# Altium schematic sheet esp32_with_usbc_1st.SchDoc
size A2; SheetNumber: 1; SheetTotal: 1
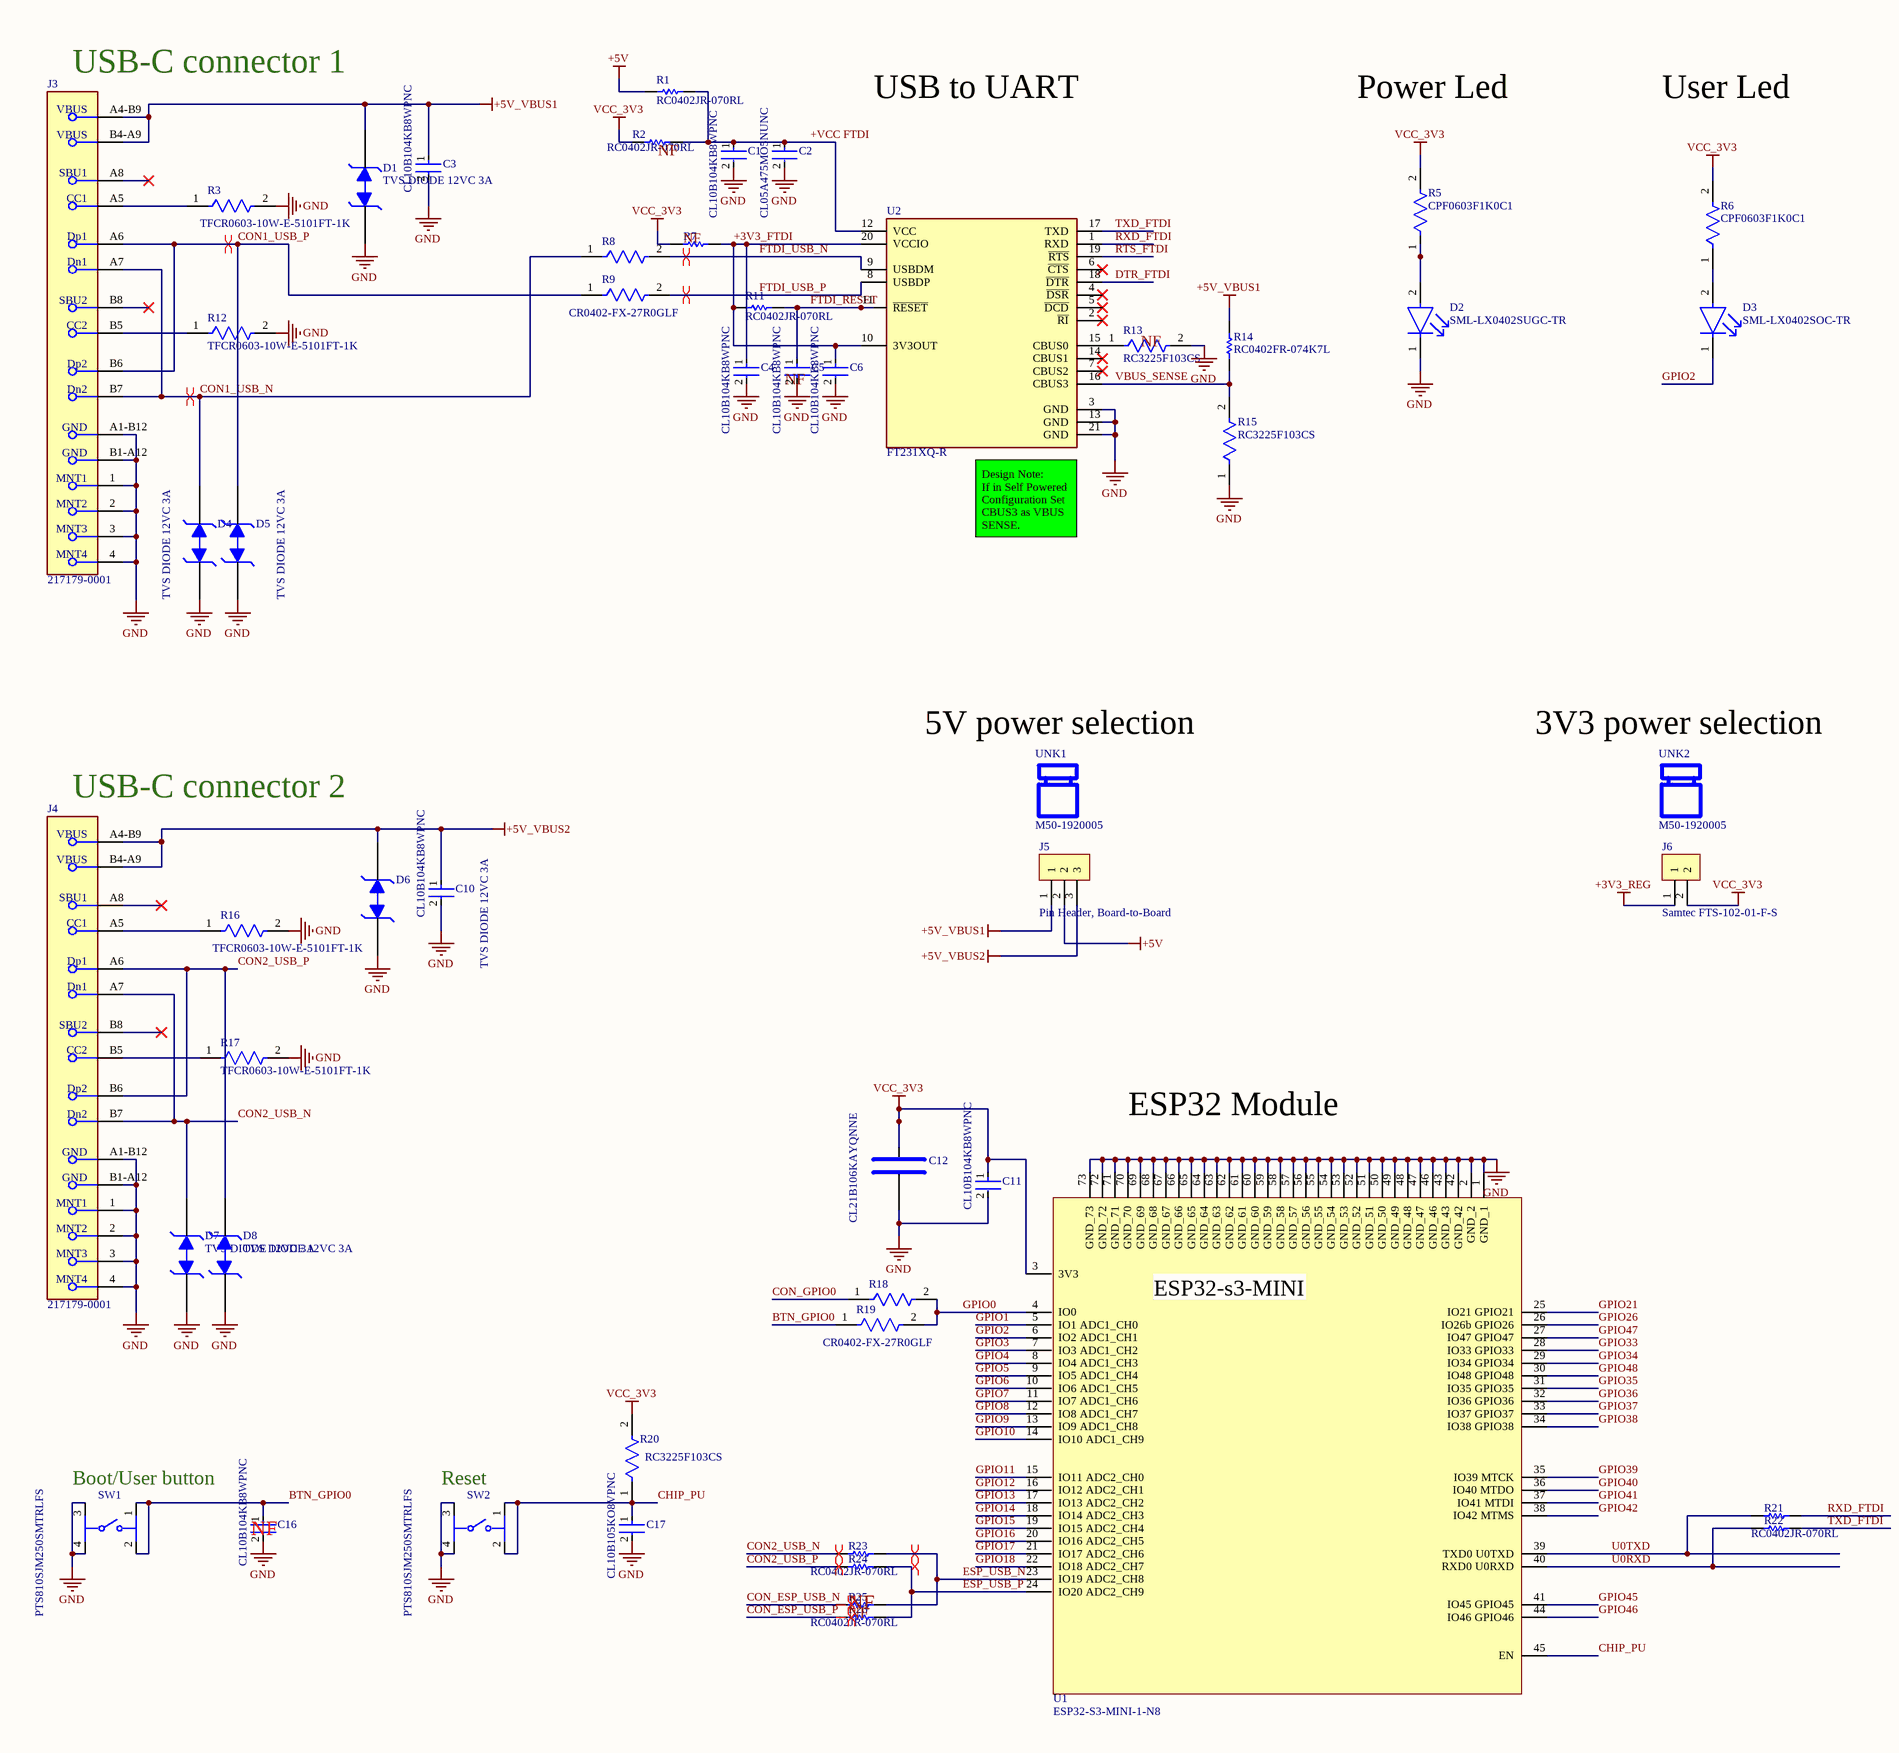
[diagram p0: esp32_with_usbc_1st.SchDoc, left]
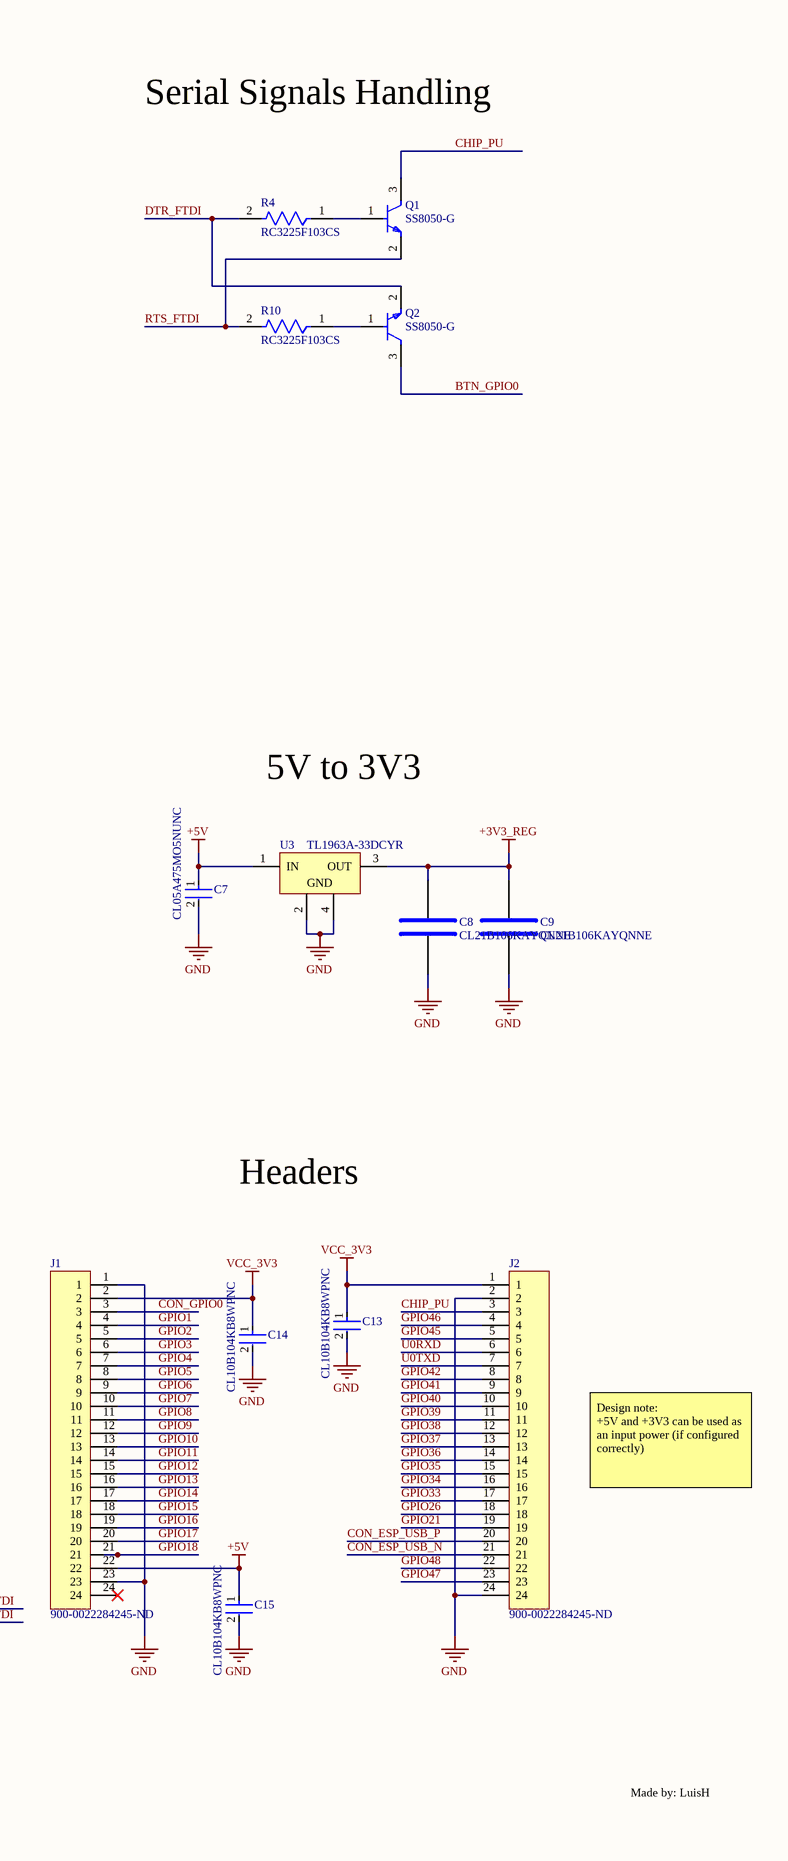
[diagram p1: esp32_with_usbc_1st.SchDoc, right]

## Parts
C1  CL10B104KB8WPNC  [FP-CL10-IPC_A]
C2  CL05A475MO5NUNC  [FP-CL829-IPC_C]
C3  CL10B104KB8WPNC  [FP-CL10-IPC_A]
C4  CL10B104KB8WPNC  [FP-CL10-IPC_A]
C5  CL10B104KB8WPNC  [FP-CL10-IPC_A]
C6  CL10B104KB8WPNC  [FP-CL10-IPC_A]
C7  CL05A475MO5NUNC  [FP-CL829-IPC_C]
C8  CL21B106KAYQNNE  [CAP_CL21B106KAYQNNE_SAM-L]
C9  CL21B106KAYQNNE  [CAP_CL21B106KAYQNNE_SAM-L]
C10  CL10B104KB8WPNC  [FP-CL10-IPC_A]
C11  CL10B104KB8WPNC  [FP-CL10-IPC_A]
C12  CL21B106KAYQNNE  [CAP_CL21B106KAYQNNE_SAM-L]
C13  CL10B104KB8WPNC  [FP-CL10-IPC_A]
C14  CL10B104KB8WPNC  [FP-CL10-IPC_A]
C15  CL10B104KB8WPNC  [FP-CL10-IPC_A]
C16  CL10B104KB8WPNC  [FP-CL10-IPC_A]
C17  CL10B105KO8VPNC  [FP-CL10-IPC_C]
D1  TVS DIODE 12VC 3A  [RTVS_SOD882_LTF]
D2  SML-LX0402SUGC-TR  [FP-SML-LX0402SUGC-TR-MFG]
D3  SML-LX0402SOC-TR  [FP-SML-LX0402SOC-TR-MFG]
D4  TVS DIODE 12VC 3A  [RTVS_SOD882_LTF]
D5  TVS DIODE 12VC 3A  [RTVS_SOD882_LTF]
D6  TVS DIODE 12VC 3A  [RTVS_SOD882_LTF]
D7  TVS DIODE 12VC 3A  [RTVS_SOD882_LTF]
D8  TVS DIODE 12VC 3A  [RTVS_SOD882_LTF]
J1  900-0022284245-ND  [CONN_SD-42375-001_M295_24_MOL]
J2  900-0022284245-ND  [CONN_SD-42375-001_M295_24_MOL]
J3  217179-0001  [FP-2171790001-MFG]
J4  217179-0001  [FP-2171790001-MFG]
J5  Pin Header, Board-to-Board  [HDR_1x3_1.27mm]
J6  Samtec FTS-102-01-F-S  [HDR_1x2_1.27mm]
Q1  SS8050-G  [FP-SS8050-G-MFG]
Q2  SS8050-G  [FP-SS8050-G-MFG]
R1  RC0402JR-070RL  [RESC1005X40X25NL05T10]
R2  RC0402JR-070RL  [RESC1005X40X25NL05T10]
R3  TFCR0603-10W-E-5101FT-1K  [FP-TFCR0603-IPC_C]
R4  RC3225F103CS  [FP-RC3225-IPC_C]
R5  CPF0603F1K0C1  [FP-CPF0603-MFG]
R6  CPF0603F1K0C1  [FP-CPF0603-MFG]
R7  RC0402JR-070RL  [RESC1005X40X25NL05T10]  (value not drawn)
R8  CR0402-FX-27R0GLF  [FP-CR0402-MFG]
R9  CR0402-FX-27R0GLF  [FP-CR0402-MFG]  (value not drawn)
R10  RC3225F103CS  [FP-RC3225-IPC_C]
R11  RC0402JR-070RL  [RESC1005X40X25NL05T10]
R12  TFCR0603-10W-E-5101FT-1K  [FP-TFCR0603-IPC_C]
R13  RC3225F103CS  [FP-RC3225-IPC_C]
R14  RC0402FR-074K7L  [RESC1005X40X25NL05T10]
R15  RC3225F103CS  [FP-RC3225-IPC_C]
R16  TFCR0603-10W-E-5101FT-1K  [FP-TFCR0603-IPC_C]
R17  TFCR0603-10W-E-5101FT-1K  [FP-TFCR0603-IPC_C]
R18  CR0402-FX-27R0GLF  [FP-CR0402-MFG]
R19  CR0402-FX-27R0GLF  [FP-CR0402-MFG]  (value not drawn)
R20  RC3225F103CS  [FP-RC3225-IPC_C]
R21  RC0402JR-070RL  [RESC1005X40X25NL05T10]
R22  RC0402JR-070RL  [RESC1005X40X25NL05T10]  (value not drawn)
R23  RC0402JR-070RL  [RESC1005X40X25NL05T10]  (value not drawn)
R24  RC0402JR-070RL  [RESC1005X40X25NL05T10]
R25  RC0402JR-070RL  [RESC1005X40X25NL05T10]  (value not drawn)
R26  RC0402JR-070RL  [RESC1005X40X25NL05T10]
SW1  PTS810SJM250SMTRLFS  [FP-PTS810SJM250SMTRLFS-MFG]
SW2  PTS810SJM250SMTRLFS  [FP-PTS810SJM250SMTRLFS-MFG]
U1  ESP32-S3-MINI-1-N8  [XCVR_ESP32-S3-MINI-1-N8]
U2  FT231XQ-R  [FP-QFN-20-IPC_B]
U3  TL1963A-33DCYR  [DCY0004A_N]
UNK1  M50-1920005  (mechanical)
UNK2  M50-1920005  (mechanical)

## Nets
+3V3_REG: C8.2 C9.2 J6.1 U3.3(OUT)
+5V: C7.1 C15.1 J1.22 J5.2 R1.1 U3.1(IN)
+5V_VBUS1: C3.1 D1.2 J3.A4-B9(VBUS) J3.B4-A9(VBUS) J5.1 R14.2
+5V_VBUS2: C10.1 D6.2 J4.A4-B9(VBUS) J4.B4-A9(VBUS) J5.3
GND: C1.2 C2.2 C3.2 C4.2 C5.2 C6.2 C7.2 C8.1 C9.1 C10.2 C11.2 C12.1 C13.2 C14.2 C15.2 C16.2 C17.2 D1.1 D2.1(C) D4.1 D5.1 D6.1 D7.1 D8.1 J1.1 J1.23 J2.2 J2.24 J3.1(GND) J3.2(GND) J3.3(GND) J3.4(GND) J3.A1-B12(GND) J3.B1-A12(GND) J4.1(GND) J4.2(GND) J4.3(GND) J4.4(GND) J4.A1-B12(GND) J4.B1-A12(GND) R3.2 R12.2 R13.2 R15.1 R16.2 R17.2 SW1.3 SW1.4 SW2.3 SW2.4 U1.1(GND_1) U1.2(GND_2) U1.42(GND_42) U1.43(GND_43) U1.46(GND_46) U1.47(GND_47) U1.48(GND_48) U1.49(GND_49) U1.50(GND_50) U1.51(GND_51) U1.52(GND_52) U1.53(GND_53) U1.54(GND_54) U1.55(GND_55) U1.56(GND_56) U1.57(GND_57) U1.58(GND_58) U1.59(GND_59) U1.60(GND_60) U1.61(GND_61) U1.62(GND_62) U1.63(GND_63) U1.64(GND_64) U1.65(GND_65) U1.66(GND_66) U1.67(GND_67) U1.68(GND_68) U1.69(GND_69) U1.70(GND_70) U1.71(GND_71) U1.72(GND_72) U1.73(GND_73) U2.3(GND) U2.13(GND) U2.21(GND) U3.2(GND) U3.4(GND)
VCC_3V3: C11.1 C12.2 C13.1 C14.1 J1.2 J2.1 J6.2 R2.1 R5.2 R6.2 R7.1 R20.2 U1.3(3V3)
+3V3_FTDI: C4.1 C6.1 R7.2 R11.1 U2.10(3V3OUT) U2.20(VCCIO)
+VCC FTDI: C1.1 C2.1 R1.2 R2.2 U2.12(VCC)
BTN_GPIO0: C16.1 Q2.3(C) R19.1 SW1.1 SW1.2
CHIP_PU: C17.1 J2.3 Q1.3(C) R20.1 SW2.1 SW2.2 U1.45(EN)
CON1_USB_N: D4.2 J3.A7(Dn1) J3.B7(Dn2) R8.1
CON1_USB_P: D5.2 J3.A6(Dp1) J3.B6(Dp2) R9.1
CON2_USB_N: D7.2 J4.A7(Dn1) J4.B7(Dn2) R23.1
CON2_USB_P: D8.2 J4.A6(Dp1) J4.B6(Dp2) R24.1
CON_ESP_USB_N: J2.21 R25.1
CON_ESP_USB_P: J2.20 R26.1
CON_GPIO0: J1.3 R18.1
DTR_FTDI: Q2.2(E) R4.2 U2.18(~{DTR})
ESP_USB_N: R23.2 R25.2 U1.23(IO19_ADC2_CH8)
ESP_USB_P: R24.2 R26.2 U1.24(IO20_ADC2_CH9)
FTDI_RESET: C5.1 R11.2 U2.11(~{RESET})
FTDI_USB_N: R8.2 U2.9(USBDM)
FTDI_USB_P: R9.2 U2.8(USBDP)
GPIO0: R18.2 R19.2 U1.4(IO0)
GPIO1: J1.4 U1.5(IO1_ADC1_CH0)
GPIO2: D3.1(C) J1.5 U1.6(IO2_ADC1_CH1)
GPIO3: J1.6 U1.7(IO3_ADC1_CH2)
GPIO4: J1.7 U1.8(IO4_ADC1_CH3)
GPIO5: J1.8 U1.9(IO5_ADC1_CH4)
GPIO6: J1.9 U1.10(IO6_ADC1_CH5)
GPIO7: J1.10 U1.11(IO7_ADC1_CH6)
GPIO8: J1.11 U1.12(IO8_ADC1_CH7)
GPIO9: J1.12 U1.13(IO9_ADC1_CH8)
GPIO10: J1.13 U1.14(IO10_ADC1_CH9)
GPIO11: J1.14 U1.15(IO11_ADC2_CH0)
GPIO12: J1.15 U1.16(IO12_ADC2_CH1)
GPIO13: J1.16 U1.17(IO13_ADC2_CH2)
GPIO14: J1.17 U1.18(IO14_ADC2_CH3)
GPIO15: J1.18 U1.19(IO15_ADC2_CH4)
GPIO16: J1.19 U1.20(IO16_ADC2_CH5)
GPIO17: J1.20 U1.21(IO17_ADC2_CH6)
GPIO18: J1.21 U1.22(IO18_ADC2_CH7)
GPIO21: J2.19 U1.25(IO21_GPIO21)
GPIO26: J2.18 U1.26(IO26b_GPIO26)
GPIO33: J2.17 U1.28(IO33_GPIO33)
GPIO34: J2.16 U1.29(IO34_GPIO34)
GPIO35: J2.15 U1.31(IO35_GPIO35)
GPIO36: J2.14 U1.32(IO36_GPIO36)
GPIO37: J2.13 U1.33(IO37_GPIO37)
GPIO38: J2.12 U1.34(IO38_GPIO38)
GPIO39: J2.11 U1.35(IO39_MTCK)
GPIO40: J2.10 U1.36(IO40_MTDO)
GPIO41: J2.9 U1.37(IO41_MTDI)
GPIO42: J2.8 U1.38(IO42_MTMS)
GPIO45: J2.5 U1.41(IO45_GPIO45)
GPIO46: J2.4 U1.44(IO46_GPIO46)
GPIO47: J2.23 U1.27(IO47_GPIO47)
GPIO48: J2.22 U1.30(IO48_GPIO48)
RTS_FTDI: Q1.2(E) R10.2 U2.19(~{RTS})
RXD_FTDI: R21.2 U2.1(RXD)
TXD_FTDI: R22.2 U2.17(TXD)
U0RXD: J2.6 R22.1 U1.40(RXD0_U0RXD)
U0TXD: J2.7 R21.1 U1.39(TXD0_U0TXD)
VBUS_SENSE: R14.1 R15.2 U2.16(CBUS3)
NetD2_2: D2.2(A) R5.1
NetD3_2: D3.2(A) R6.1
NetJ3_A5: J3.A5(CC1) R3.1
NetJ3_B5: J3.B5(CC2) R12.1
NetJ4_A5: J4.A5(CC1) R16.1
NetJ4_B5: J4.B5(CC2) R17.1
NetQ1_1: Q1.1(B) R4.1
NetQ2_1: Q2.1(B) R10.1
NetR13_1: R13.1 U2.15(CBUS0)

Not connected (* = marked no-connect by the designer): J1 24*; J3 A8(SBU1)* B8(SBU2)*; J4 A8(SBU1)* B8(SBU2)*; U2 2(~{RI})* 4(~{DSR})* 5(~{DCD})* 6(~{CTS})* 7(CBUS2)* 14(CBUS1)*

## Layout directives
differential pair; net class DIFF90; differential pair class DIFF90: CON1_USB_N, CON1_USB_P, CON2_USB_N, CON2_USB_P, CON_ESP_USB_N, CON_ESP_USB_P, ESP_USB_N, ESP_USB_P, FTDI_USB_N, FTDI_USB_P

## Notes on the sheet
- (near J3) USB-C connector 1
- USB to UART
- Power Led
- User Led
- Serial Signals Handling
- (near R2) NF
- (near R7) NF
- (near R13) NF
- (near C5) NF
- (near U2) Design Note:
  If in Self Powered Configuration Set CBUS3 as VBUS SENSE.
- (near UNK1) 5V power selection
- (near UNK2) 3V3 power selection
- 5V to 3V3
- (near J4) USB-C connector 2
- ESP32 Module
- Headers
- Design note:                        +5V and +3V3 can be used as an input power (if configured correctly)
- Boot/User button
- (near SW2) Reset button
- (near C16) NF
- NF
- (near R25) NF
- ESP32 with usb c
- Made by: LuisH
- (in symbol 217179-0001) MNT1; MNT2; MNT3; MNT4
- (in symbol ESP32-S3-MINI-1-N8) ESP32-s3-MINI

## Library data of the parts
C1 C3-C6 C10 C11 C13-C16 = CMP-13271-002353-1: Cap Ceramic 100nF 50V X7R ±10% Pad SMD 0603 +125°C T/R; Ratings: AEC-Q200; Capacitance: 100nF; Features: Soft Termination; Max Operating Temperature: 125°C; Mount: Surface Mount; Case/Package: 0603; Width: 0.031inch; Voltage Rating: 50V; Case Code (Metric): 1608; Case Code (Imperial): 0603; Tolerance: 10%; Min Operating Temperature: -55°C; Thickness: 0.035inch; Lead Free: Lead Free; Packaging: Tape and Reel; Length: 0.063inch
C2 C7 = CMP-13271-001468-1: Cap Ceramic 4.7uF 16V X5R ±20% SMD 0402 +85°C Paper T/R; Mount: Surface Mount; Case Code (Metric): 1005; Case/Package: 0402; Length: 0.039inch; Capacitance: 4.7uF; Voltage Rating: 16V; Max Operating Temperature: 85°C; Tolerance: 20%; Thickness: 0.022inch; Min Operating Temperature: -55°C; Case Code (Imperial): 0402; Packaging: Tape and Reel; Width: 0.02inch
C8 C9 C12 = CL21B106KAYQNNE: 25V 10uF X7R 卤10% 0805 Multilayer Ceramic Capacitors MLCC - SMD/SMT ROHS; Manufacturer: Samsung Electro-Mechanics; Value: 10µF; Tolerance: 10%; Supplier: Newark; Supplier Part Number: CL21B106KAYQNNE; Manufacturer Part Number: CL21B106KAYQNNE; RoHS: Compliant; Category: Ceramic Capacitors; Pricing: 5=0.359, 25=0.214, 100=0.142, 250=0.128, 500=0.114, 1000=0.105, 2500=0.103, 5000=0.101 (USD); Case/Package: 0805; China RoHS: Compliant; Country of Origin: Mainland China, Philippines, South Korea; Dielectric Material: Ceramic; Export Control Classification Number (ECCN) Code: EAR99; Height: 1.45mm; Harmonized Tariff Schedule (HTS) Code: 8532.24.00.20; Introduction Date: 2017-09-12; Lifecycle Status: Production; Material: Ceramic; Max Operating Temperature: 125°C; Min Operating Temperature: -55°C; Mounting Technology: Surface Mount; Number of Terminals: 2; REACH SVHC: Yes; Voltage Rating: 25V; Voltage Rating (DC): 25V; ComponentLink1URL: https://datasheet.octopart.com:443/CL21B106KAYQNNE-Samsung-Electro-Mechanics-datasheet-181551887.pdf?src-supplier=Newark; ComponentLink1Description: https://datasheet.octopart.com:443/CL21B106KAYQNNE-Samsung-Electro-Mechanics-datasheet-181551887.pdf?src-supplier=Newark; ComponentLink2URL: https://datasheet.octopart.com:443/CL21B106KAYQNNE-Samsung-Electro-Mechanics-datasheet-149045937.pdf?src-supplier=Future+Electronics; ComponentLink2Description: https://datasheet.octopart.com:443/CL21B106KAYQNNE-Samsung-Electro-Mechanics-datasheet-149045937.pdf?src-supplier=Future+Electronics
C17 = CMP-13271-002188-1: Cap Ceramic 1uF 16V X7R ±10% Pad SMD 0603 +125°C T/R; Width: 0.031inch; Max Operating Temperature: 125°C; Case/Package: 0603; Features: Soft Termination; Mount: Surface Mount; Min Operating Temperature: -55°C; Packaging: Tape and Reel; Dielectric: X7R; Voltage Rating: 16V; Capacitance: 1uF; Thickness: 0.035inch; Length: 0.063inch; Depth: 0.8mm; Lead Free: Lead Free; Tolerance: 10%; Ratings: AEC-Q200; Case Code (Imperial): 0603; Case Code (Metric): 1608
D1 D4-D8 = AQ3045-01ETG: TVS DIODE 12VC 3A SOD882 / ESD Suppressor TVS Bi-Dir 5.3V Automotive 2-Pin SOD-882 T/R; Manufacturer: Littelfuse; Breakdown Voltage: 7.8V; Clamping Voltage: 12V; Leakage Current: 100nA; Max Breakdown Voltage: 9V; Min Breakdown Voltage: 6.8V; Number of Channels: 1; Peak Pulse Power: 40W; Polarity: Bidirectional; Supplier: DigiKey; Supplier Part Number: F9321CT-ND; Manufacturer Part Number: AQ3045-01ETG; RoHS: Compliant; Category: TVS Diodes; Stock: 87918; Pricing: 1=0.71, 10=0.44, 50=0.3204, 100=0.2817, 500=0.21354 (USD); Lifecycle Status: Production; Max Operating Temperature: 150°C; Min Operating Temperature: -40°C; Mounting Technology: Surface Mount; Number of Elements: 1; Number of Terminals: 2; Operating Supply Voltage: 5.3V; Packaging: Cut Tape; Peak Reverse Current: 100nA; Ratings: AEC-Q101; REACH SVHC: Yes; Reverse Standoff Voltage: 5.3V; ComponentLink1URL: https://datasheet.octopart.com:443/AQ3045-01ETG-Littelfuse-datasheet-180606588.pdf?src-supplier=IHS; ComponentLink1Description: https://datasheet.octopart.com:443/AQ3045-01ETG-Littelfuse-datasheet-180606588.pdf?src-supplier=IHS; ComponentLink2URL: https://datasheet.octopart.com:443/AQ3045-01ETG-Littelfuse-datasheet-140480283.pdf?src-supplier=ODG+(Origin+Data+Global); ComponentLink2Description: https://datasheet.octopart.com:443/AQ3045-01ETG-Littelfuse-datasheet-140480283.pdf?src-supplier=ODG+(Origin+Data+Global); ComponentLink3URL: https://datasheet.octopart.com:443/AQ3045-01ETG-Littelfuse-datasheet-101609968.pdf?src-supplier=Farnell; ComponentLink3Description: https://datasheet.octopart.com:443/AQ3045-01ETG-Littelfuse-datasheet-101609968.pdf?src-supplier=Farnell; ComponentLink4URL: https://datasheet.octopart.com:443/AQ3045-01ETG-Littelfuse-datasheet-183003566.pdf?src-supplier=JRH+Electronics; ComponentLink4Description: https://datasheet.octopart.com:443/AQ3045-01ETG-Littelfuse-datasheet-183003566.pdf?src-supplier=JRH+Electronics; ComponentLink5URL: https://datasheet.octopart.com:443/AQ3045-01ETG-Littelfuse-datasheet-170904929.pdf?src-supplier=Future+Electronics; ComponentLink5Description: https://datasheet.octopart.com:443/AQ3045-01ETG-Littelfuse-datasheet-170904929.pdf?src-supplier=Future+Electronics; LCSC part number: C3710326
D2 = CMP-57192-000001-1: LED GREEN CLEAR SMD; Forward Voltage: 2.2V; Test Current: 20mA; Luminous Intensity: 45mcd; Lens Style: Diffused; Number of LEDs: 1; Approvals: UL; Lens Color: Colorless; Dominant Wavelength: 574nm; Viewing Angle: 120°; Lead Free: Lead Free; Case/Package: 0402; Number of Pins: 2; Width: 0.5mm; Min Operating Temperature: -40°C; Case Code (Imperial): 0402; Packaging: Tape and Reel; Color: Green; Max Operating Temperature: 85°C; Case Code (Metric): 1005; Mount: Surface Mount; Length: 1mm; Wavelength: 574nm; Height: 0.5mm; Illumination Color: Green; Lens Transparency: Clear; Package Quantity: 1; Forward Current: 20mA
D3 = CMP-57192-000002-1: LED ORANGE CLEAR SMD; Forward Voltage: 2V; Viewing Angle: 120°; Luminous Intensity: 120mcd; Wavelength: 610nm; Forward Current: 20mA; Number of LEDs: 1; Lens Color: Colorless; Max Operating Temperature: 85°C; Mount: Surface Mount; Lens Transparency: Clear; Lens Style: Clear; Case Code (Metric): 1005; Length: 1mm; Package Quantity: 1; Case Code (Imperial): 0402; Color: Orange; Illumination Color: Orange; Width: 0.5mm; Packaging: Tape and Reel; Test Current: 20mA; Min Operating Temperature: -40°C; Height: 0.5mm; Number of Pins: 2; Lead Free: Lead Free; Case/Package: 0402
J1 J2 = 22-28-4245: KK 254 Breakaway Header, Vertical, 24 Circuits, 0.38µm Gold (Au) Plating, Mating Pin Length 7.49mm, Bag; Manufacturer: Molex; Manufacturer Lifecycle Status: ACTIVE; Contact Resistance: 10mΩ; Current Rating: 4A; Gender: Male; Insulation Resistance: 1GΩ; Number of Circuits: 24; Operating Force: 4.9N; Pitch: 2.54mm; Plating: Tin; Plating Thickness: 381nm; Ratings: CSA; Supplier: DigiKey; Supplier Part Number: 900-0022284245-ND; Manufacturer Part Number: 22-28-4245; RoHS: Compliant; Category: Headers and Wire Housings; Stock: 574; Pricing: 1=4.05, 10=3.444, 100=2.9267, 500=2.61254, 1000=2.48792 (USD); China RoHS: Compliant; Color: Black; Contact Material: Brass; Contact Plating: Gold; Country of Origin: US; Export Control Classification Number (ECCN) Code: EAR99; Housing Color: Black; Harmonized Tariff Schedule (HTS) Code: 8536.69.40.40; Insulation Color: Black; Introduction Date: 1994-12-01; Lead Free: Lead Free; Lifecycle Status: Production; Max Operating Temperature: 75°C; Min Operating Temperature: -40°C; Mounting Technology: Through Hole; Number of Contacts: 24; Pins: 24; Number of Positions: 24; Number of Rows: 1; Orientation: Vertical; Packaging: Bulk; REACH SVHC: Yes; Schedule B: 8536694040, 8536694040|8536694040|8536694040|8536694040|8536694040; Terminal Pitch: 2.54mm; Termination: Solder; ComponentLink1URL: https://datasheet.octopart.com:443/22-28-4245-Molex-datasheet-166051265.pdf?src-supplier=IHS; ComponentLink1Description: https://datasheet.octopart.com:443/22-28-4245-Molex-datasheet-166051265.pdf?src-supplier=IHS; ComponentLink2URL: https://datasheet.octopart.com:443/022284245-Molex-datasheet-8337137.pdf?src-supplier=Arrow+Electronics; ComponentLink2Description: https://datasheet.octopart.com:443/022284245-Molex-datasheet-8337137.pdf?src-supplier=Arrow+Electronics; ComponentLink3URL: https://datasheet.octopart.com:443/22-28-4245-Molex-datasheet-16300812.pdf?src-supplier=Molex; ComponentLink3Description: https://datasheet.octopart.com:443/22-28-4245-Molex-datasheet-16300812.pdf?src-supplier=Molex; ComponentLink4URL: https://sigma.octopart.com:443/16300370/technical_drawing/Molex-22-28-4245.pdf?src-supplier=Molex; ComponentLink4Description: https://sigma.octopart.com:443/16300370/technical_drawing/Molex-22-28-4245.pdf?src-supplier=Molex; ComponentLink5URL: https://datasheet.octopart.com:443/22-28-4245-Molex-datasheet-4210.pdf?src-supplier=DigiKey; ComponentLink5Description: https://datasheet.octopart.com:443/22-28-4245-Molex-datasheet-4210.pdf?src-supplier=DigiKey; ComponentLink6URL: http://sigma.octopart.com:80/16300813/rohs_statement/Molex-22-28-4245.pdf?src-supplier=Compliance+Statements; ComponentLink6Description: http://sigma.octopart.com:80/16300813/rohs_statement/Molex-22-28-4245.pdf?src-supplier=Compliance+Statements; ComponentLink7URL: http://sigma.octopart.com:80/reach_statement/Molex-company-74.pdf?src-supplier=Compliance+Statements; ComponentLink7Description: http://sigma.octopart.com:80/reach_statement/Molex-company-74.pdf?src-supplier=Compliance+Statements; ComponentLink8URL: http://sigma.octopart.com:80/rohs_statement/Molex-company-73.pdf?src-supplier=Compliance+Statements; ComponentLink8Description: http://sigma.octopart.com:80/rohs_statement/Molex-company-73.pdf?src-supplier=Compliance+Statements; ComponentLink9URL: http://sigma.octopart.com:80/conflict_mineral_statement/Molex-company-72.pdf?src-supplier=Compliance+Statements; ComponentLink9Description: http://sigma.octopart.com:80/conflict_mineral_statement/Molex-company-72.pdf?src-supplier=Compliance+Statements; LCSC part number: C7145888
J3 J4 = 217179-0001: USB Connector, 16 Contact(s), Female, Right Angle, Surface Mount Terminal, Locking, Receptacle; Manufacturer: Molex; Manufacturer Lifecycle Status: ACTIVE; Contact Resistance: 50mΩ; Current Rating: 1.25A; Dielectric Material: Polyamide; Insulation Resistance: 100MΩ; Number of Contacts: 16; Number of Ports: 1; USB Standard: USB 2.0; Voltage Rating: 30V; Supplier: Avnet; Supplier Part Number: 217179-0001; Manufacturer Part Number: 217179-0001; RoHS: Compliant; Category: USB Connectors; Stock: 28800; Pricing: 7200=0.4445, 21600=0.38415, 43200=0.3822, 86400=0.38025, 201600=0.3783 (USD); China RoHS: Compliant; Contact Material: Gold, Nickel; Country of Origin: Mainland China; Export Control Classification Number (ECCN) Code: EAR99; Gender: Female; Height: 3.36mm; Harmonized Tariff Schedule (HTS) Code: 8536.69.40.30; Insulation Color: Black; Introduction Date: 2021-08-30; Lifecycle Status: Production; Max Operating Temperature: 85°C; Min Operating Temperature: -40°C; Number of Positions: 16; Number of Rows: 1; Orientation: Right Angle; REACH SVHC: Yes; Shell Finish: Nickel; Shell Material: Stainless Steel; Terminal Pitch: 500µm; ComponentLink1URL: https://datasheet.octopart.com:443/217179-0001-Molex-datasheet-158871109.pdf?src-supplier=ODG+(Origin+Data+Global); ComponentLink1Description: https://datasheet.octopart.com:443/217179-0001-Molex-datasheet-158871109.pdf?src-supplier=ODG+(Origin+Data+Global); ComponentLink2URL: https://sigma.octopart.com:443/158871110/technical_drawing/Molex-217179-0001.pdf?src-supplier=Upverter; ComponentLink2Description: https://sigma.octopart.com:443/158871110/technical_drawing/Molex-217179-0001.pdf?src-supplier=Upverter; ComponentLink3URL: https://datasheet.octopart.com:443/217179-0001-Molex-datasheet-164573281.pdf?src-supplier=RS+(Formerly+Allied+Electronics); ComponentLink3Description: https://datasheet.octopart.com:443/217179-0001-Molex-datasheet-164573281.pdf?src-supplier=RS+(Formerly+Allied+Electronics); ComponentLink4URL: http://sigma.octopart.com:80/reach_statement/Molex-company-74.pdf?src-supplier=Compliance+Statements; ComponentLink4Description: http://sigma.octopart.com:80/reach_statement/Molex-company-74.pdf?src-supplier=Compliance+Statements; ComponentLink5URL: http://sigma.octopart.com:80/rohs_statement/Molex-company-73.pdf?src-supplier=Compliance+Statements; ComponentLink5Description: http://sigma.octopart.com:80/rohs_statement/Molex-company-73.pdf?src-supplier=Compliance+Statements; ComponentLink6URL: http://sigma.octopart.com:80/conflict_mineral_statement/Molex-company-72.pdf?src-supplier=Compliance+Statements; ComponentLink6Description: http://sigma.octopart.com:80/conflict_mineral_statement/Molex-company-72.pdf?src-supplier=Compliance+Statements
J5 = FTS-103-01-F-S: Pin Header, Board-to-Board, Wire-to-Board, 3.4 A, 1.27 mm, 1 Rows, 3 Contacts, Through Hole; Manufacturer: Samtec; Manufacturer Lifecycle Status: PRODUCTION; Gender: Male; Number of Contacts: 3; Pitch: 1.27mm; Supplier: DigiKey; Supplier Part Number: 612-FTS-103-01-F-S-ND; Manufacturer Part Number: FTS-103-01-F-S; RoHS: Compliant; Category: Board to Board Connectors; Stock: 3233; Pricing: 1=0.73, 50=0.638, 100=0.541, 500=0.449, 1000=0.384, 2000=0.314, 5000=0.30344 (USD); Contact Plating: Gold; Lifecycle Status: Production; Mounting Technology: Through Hole; Number of Rows: 1; Packaging: Bulk; Radiation Hardening: No; Termination: Solder; ComponentLink1URL: https://datasheet.octopart.com:443/FTS-103-01-F-S-Samtec-datasheet-97029283.pdf?src-supplier=Newark; ComponentLink1Description: https://datasheet.octopart.com:443/FTS-103-01-F-S-Samtec-datasheet-97029283.pdf?src-supplier=Newark; ComponentLink2URL: https://datasheet.octopart.com:443/FTS-103-01-F-S-Samtec-datasheet-165596534.pdf?src-supplier=Newark; ComponentLink2Description: https://datasheet.octopart.com:443/FTS-103-01-F-S-Samtec-datasheet-165596534.pdf?src-supplier=Newark; ComponentLink3URL: https://sigma.octopart.com:443/97029285/technical_drawing/Samtec-FTS-103-01-F-S.pdf?src-supplier=element14+APAC; ComponentLink3Description: https://sigma.octopart.com:443/97029285/technical_drawing/Samtec-FTS-103-01-F-S.pdf?src-supplier=element14+APAC; ComponentLink4URL: https://datasheet.octopart.com:443/FTS-103-01-F-S-Samtec-datasheet-118493358.pdf?src-supplier=Electro+Sonic; ComponentLink4Description: https://datasheet.octopart.com:443/FTS-103-01-F-S-Samtec-datasheet-118493358.pdf?src-supplier=Electro+Sonic; ComponentLink5URL: https://datasheet.octopart.com:443/FTS-103-01-F-S-Samtec-datasheet-176663378.pdf?src-supplier=Toby+Electronics; ComponentLink5Description: https://datasheet.octopart.com:443/FTS-103-01-F-S-Samtec-datasheet-176663378.pdf?src-supplier=Toby+Electronics; ComponentLink6URL: https://datasheet.octopart.com:443/FTS-103-01-F-S-Samtec-datasheet-116535195.pdf?src-supplier=Toby+Electronics; ComponentLink6Description: https://datasheet.octopart.com:443/FTS-103-01-F-S-Samtec-datasheet-116535195.pdf?src-supplier=Toby+Electronics; ComponentLink7URL: https://datasheet.octopart.com:443/FTS-103-01-F-S-Samtec-datasheet-136395376.pdf?src-supplier=Toby+Electronics; ComponentLink7Description: https://datasheet.octopart.com:443/FTS-103-01-F-S-Samtec-datasheet-136395376.pdf?src-supplier=Toby+Electronics; ComponentLink8URL: https://datasheet.octopart.com:443/FTS-103-01-F-S-Samtec-datasheet-151470456.pdf?src-supplier=Sager+Electronics; ComponentLink8Description: https://datasheet.octopart.com:443/FTS-103-01-F-S-Samtec-datasheet-151470456.pdf?src-supplier=Sager+Electronics; LCSC part number: C3333578
J6 = FTS-102-01-F-S: Pin Header, Board-to-Board, 1.27 mm, 1 Rows, 2 Contacts, Through Hole Straight, FTS Series; Manufacturer Lifecycle Status: PRODUCTION; Gender: Male; Number of Contacts: 2; Pitch: 1.27mm; Supplier: Arrow Electronics; Supplier Part Number: FTS-102-01-F-S; Manufacturer: Samtec; Manufacturer Part Number: FTS-102-01-F-S; RoHS: Compliant; Category: Headers and Wire Housings; Stock: 6785; Pricing: 1=0.487, 50=0.425, 100=0.361, 500=0.299, 1000=0.256, 2000=0.21, 5000=0.166 (USD); Contact Plating: Gold; Lifecycle Status: Production; Mounting Technology: Through Hole; Number of Rows: 1; Packaging: Bulk; Radiation Hardening: No; Termination: Solder; ComponentLink1URL: https://datasheet.octopart.com:443/FTS-102-01-F-S-Samtec-datasheet-97029283.pdf?src-supplier=Newark; ComponentLink1Description: https://datasheet.octopart.com:443/FTS-102-01-F-S-Samtec-datasheet-97029283.pdf?src-supplier=Newark; ComponentLink2URL: https://sigma.octopart.com:443/97029285/technical_drawing/Samtec-FTS-102-01-F-S.pdf?src-supplier=Newark; ComponentLink2Description: https://sigma.octopart.com:443/97029285/technical_drawing/Samtec-FTS-102-01-F-S.pdf?src-supplier=Newark; ComponentLink3URL: https://datasheet.octopart.com:443/FTS-102-01-F-S-Samtec-datasheet-118493358.pdf?src-supplier=Electro+Sonic; ComponentLink3Description: https://datasheet.octopart.com:443/FTS-102-01-F-S-Samtec-datasheet-118493358.pdf?src-supplier=Electro+Sonic; ComponentLink4URL: https://datasheet.octopart.com:443/FTS-102-01-F-S-Samtec-datasheet-165596534.pdf?src-supplier=JRH+Electronics; ComponentLink4Description: https://datasheet.octopart.com:443/FTS-102-01-F-S-Samtec-datasheet-165596534.pdf?src-supplier=JRH+Electronics; ComponentLink5URL: https://datasheet.octopart.com:443/FTS-102-01-F-S-Samtec-datasheet-176663378.pdf?src-supplier=Toby+Electronics; ComponentLink5Description: https://datasheet.octopart.com:443/FTS-102-01-F-S-Samtec-datasheet-176663378.pdf?src-supplier=Toby+Electronics; ComponentLink6URL: https://datasheet.octopart.com:443/FTS-102-01-F-S-Samtec-datasheet-116535195.pdf?src-supplier=Toby+Electronics; ComponentLink6Description: https://datasheet.octopart.com:443/FTS-102-01-F-S-Samtec-datasheet-116535195.pdf?src-supplier=Toby+Electronics; ComponentLink7URL: https://datasheet.octopart.com:443/FTS-102-01-F-S-Samtec-datasheet-136395376.pdf?src-supplier=Toby+Electronics; ComponentLink7Description: https://datasheet.octopart.com:443/FTS-102-01-F-S-Samtec-datasheet-136395376.pdf?src-supplier=Toby+Electronics; ComponentLink8URL: https://datasheet.octopart.com:443/FTS-102-01-F-S-Samtec-datasheet-151470456.pdf?src-supplier=Sager+Electronics; ComponentLink8Description: https://datasheet.octopart.com:443/FTS-102-01-F-S-Samtec-datasheet-151470456.pdf?src-supplier=Sager+Electronics; LCSC part number: C6045317
Q1 Q2 = CMP-20235-000001-1: NPN TRANSISTOR 1.5A 40V SOT-23 R; Transition Frequency: 100MHz; Max Breakdown Voltage: 25V; Collector Emitter Voltage (VCEO): 400mV; Max Power Dissipation: 300mW; Max Collector Current: 1.5A; Case/Package: TO-236-3; Packaging: Tape and Reel; RoHS Compliant: Yes; Mount: Surface Mount; Collector Emitter Breakdown Voltage: 25V
R1 R2 R7 R11 R21-R26 = CMP-1011-00001-2: Manufacturer: Yageo / Phycomp; Part Number: RC0402JR-070RL
R3 R12 R16 R17 = CMP-250906-189493-1: RES Thin Film,  5.1kΩ, 1%, 0.1W, 25ppm/°C, 0603
R4 R10 R13 R15 R20 = CMP-13261-001525-1: Res Thick Film 1210 10kΩ 1% 0.333W ±100ppm/°C Pad SMD T/R; Resistance: 10kR; Power Rating: 333mW; Voltage Rating (DC): 200V; Lead Free: Lead Free; Case/Package: 1210
R5 R6 = CMP-03211-002621-1: RES SMD 1.0KΩ 1% 1/16W 0603; Manufacturer: TE Connectivity; Power Rating: 0.063W; Voltage Rating: 50V; Temperature Coefficient: 50ppm/°C; Octopart: https://octopart.com/cpf0603f1k0c1-te+connectivity-42013134; packaging: 1k Reel; Category: Res; Device Class L3: Chip SMD Resistors; octopart_url: https://octopart.com/cpf0603f1k0c1-te+connectivity-42013134; Value: 1.0KΩ; Temperature: -55°C to +155°C; Composition: Thin Film; ComponentLink2URL: https://www.te.com/commerce/DocumentDelivery/DDEController?Action=showdoc&DocId=Data+Sheet%7F1773200%7FM%7Fpdf%7FEnglish%7FENG_DS_1773200_M.pdf%7F3-1676481-2; Tolerance: 1%; Automotive: No; Lead Free: Yes; Height: 0.55mm; Device Class L1: Passive Components; Device Class L2: Resistors; Ipc Land Pattern Name: RESC15580X45; Series: CPF; ComponentLink2Description: Datasheet; RoHS: TRUE; Resistance: 1.0KΩ; Package: CPF0603; Manufacturer Part Number: CPF0603F1K0C1; Temperature Range Low: -55°C; Temperature Range High: +155°C
R8 R9 R18 R19 = CMP-1011-00331-3: Thick Film Chip Resistors 0402 27Ω 0.0625W 1% 100ppm/°C; Resistance: 27R; Power Rating: 62.5mW; Max Power Dissipation: 63mW; Voltage Rating: 50V; Length: 0.039inch; Width: 0.5mm; Radiation Hardening: No; Case Code (Metric): 1005; Max Operating Temperature: 125°C; Case/Package: 0402; Contact Plating: Tin; Height: 0.016inch; Case Code (Imperial): 0402; Number of Terminations: 2; Thickness: 356um; Temperature Coefficient: 100ppm/°C; Min Operating Temperature: -55°C; Package Quantity: 10000; Packaging: Tape and Reel; Composition: Thick Film; Termination: SMD/SMT; Mount: Surface Mount; Tolerance: 1%
R14 = CMP-1011-00586-2: Manufacturer: Yageo / Phycomp; Part Number: RC0402FR-074K7L
SW1 SW2 = CMP-10040-000001-2: SWITCH TACTILE SPST-NO 0.05A 16V; Throw Configuration: SPST; Operating Force: 160gf; Actuator Type: Standard; Switch Travel: 0.15mm; Switch Function: Off-Mom; Max Current Rating: 50mA; Mechanical Life: 150000Cycles; Illumination Type: Non-Illuminated; Package Quantity: 2900; Depth: 4.6mm; Mount: Surface Mount; Packaging: Tape and Reel; Length: 3.2mm; RoHS Compliant: Yes; Case/Package: SMD/SMT; Voltage Rating (DC): 16V; Min Operating Temperature: -40°C; Termination: J-Bend; Lead Free: Lead Free; Contact Plating: Silver; Orientation: Straight; Max Operating Temperature: 85°C; Current Rating: 50mA; Color: Black
U1 = ESP32-S3-MINI-1-N8: SMD module, ESP32-S3FN8, 8 MB SPI flash, PCB antenna; Manufacturer: Espressif Systems; Supplier: Future Electronics; Supplier Part Number: ESP32-S3-MINI-1-N8; Manufacturer Part Number: ESP32-S3-MINI-1-N8; RoHS: Compliant; Category: RF Transceiver Modules and Modems; Stock: 18850; Pricing: 650=3.22 (USD); ComponentLink1URL: https://datasheet.octopart.com:443/ESP32-S3-MINI-1-N8-Espressif-Systems-datasheet-194171672.pdf?src-supplier=LCSC; ComponentLink1Description: https://datasheet.octopart.com:443/ESP32-S3-MINI-1-N8-Espressif-Systems-datasheet-194171672.pdf?src-supplier=LCSC; ComponentLink2URL: https://datasheet.octopart.com:443/ESP32-S3-MINI-1-N8-Espressif-Systems-datasheet-188867343.pdf?src-supplier=TME; ComponentLink2Description: https://datasheet.octopart.com:443/ESP32-S3-MINI-1-N8-Espressif-Systems-datasheet-188867343.pdf?src-supplier=TME; ComponentLink3URL: https://datasheet.octopart.com:443/ESP32-S3-MINI-1-N8-Espressif-Systems-datasheet-165560562.pdf?src-supplier=TME; ComponentLink3Description: https://datasheet.octopart.com:443/ESP32-S3-MINI-1-N8-Espressif-Systems-datasheet-165560562.pdf?src-supplier=TME; ComponentLink4URL: https://datasheet.octopart.com:443/ESP32-S3-MINI-1-N8-Espressif-Systems-datasheet-165560559.pdf?src-supplier=TME; ComponentLink4Description: https://datasheet.octopart.com:443/ESP32-S3-MINI-1-N8-Espressif-Systems-datasheet-165560559.pdf?src-supplier=TME; ComponentLink5URL: https://datasheet.octopart.com:443/ESP32-S3-MINI-1-N8-Espressif-Systems-datasheet-192318068.pdf?src-supplier=HQonline; ComponentLink5Description: https://datasheet.octopart.com:443/ESP32-S3-MINI-1-N8-Espressif-Systems-datasheet-192318068.pdf?src-supplier=HQonline; LCSC Part Number: C2913206
U2 = FT231XQ-R: IC USB SERIAL FULL UART 20QFN; Data Rate: 12Mbps; Operating Supply Current: 8mA; Min Supply Voltage: 2.97V; Max Supply Voltage: 5.5V; Number of Channels: 1; Min Operating Temperature: -40°C; Case/Package: QFN; Mount: Surface Mount; Number of Pins: 20; Interface: UART; Lead Free: Lead Free; Package Quantity: 5000; Weight: 0.004339oz; Packaging: Tape and Reel; Max Operating Temperature: 85°C; LCSC part number: C132159
U3 = CMP-0395-00535-2: Single Output Low Noise LDO, 1.5 A, Fixed 3.3 V Output, 2.1 to 20 V Input, 4-pin SOT-223 (DCY), -40 to 125 degC, Green (RoHS & no Sb/Br); Manufacturer: Texas Instruments; Vout Adj(Min)(V): 3.3; Vin(Max)(V): 20; SubFamily: Single Channel LDO; Iq(Typ)(mA): 1; Iout(Max)(A): 1.5; Vin(Min)(V): 2.1; Vdo(Typ)(mV): 340; Accuracy(%): 3; ComponentLink2Description: Datasheet; PackageVersion: 4202506/B; PackageReference: DCY0004A; ComponentLink1Description: Manufacturer URL; Eco-Plan: Green (RoHS & no Sb/Br); ComponentLink1URL: http://www.ti.com/; Fixed Output Options(V): 3.3; ComponentLink2URL: http://www.ti.com/general/docs/lit/getliterature.tsp?genericPartNumber=TL1963A-33&fileType=pdf; Vout Adj(Max)(V): 3.3; PackageDescription: 4-Pin Plastic Small Outline, Body 3.5 x 6.5 mm, Pitch 2.3 mm; ComponentLink3URL: http://www.ti.com/litv/pdf/mpds094a; DatasheetVersion: SLVS719F; PartNumber: TL1963A-33DCYR; Code_JEDEC: TO-261; Mounting Technology: Surface Mount; ComponentLink3Description: Package Specification
UNK1 UNK2 = M50-1920005: Jumper (Busbar), Jumper Socket, Pin Hdrs; |Harwin M50-1920005; Manufacturer: Harwin; Contact Resistance: 20mΩ; Current Rating: 1A; Gender: Female; Insulation Resistance: 1GΩ; Number of Positions: 2; Pitch: 1.27mm; Voltage Rating: 500V; Supplier: DigiKey; Supplier Part Number: 952-1727-ND; Manufacturer Part Number: M50-1920005; RoHS: Compliant; Category: Shunts and Jumpers; Stock: 13246; Pricing: 1=0.35, 10=0.296, 25=0.2768, 50=0.2638, 100=0.2511, 250=0.23532, 500=0.22408, 1000=0.21336, 3000=0.19744 (USD); Color: Red; Contact Plating: Gold; Country of Origin: Mainland China; Export Control Classification Number (ECCN) Code: EAR99; Flammability Rating: UL94 V-0; Height: 2.9972mm; Housing Material: Nylon; Insulation Color: Red; Introduction Date: 2011-08-01; Lifecycle Status: Production; Max Operating Temperature: 105°C; Min Operating Temperature: -40°C; Pins: 2; Orientation: Straight; REACH SVHC: Yes; ComponentLink1URL: https://datasheet.octopart.com:443/M50-1920005-Harwin-datasheet-179992058.pdf?src-supplier=IHS; ComponentLink1Description: https://datasheet.octopart.com:443/M50-1920005-Harwin-datasheet-179992058.pdf?src-supplier=IHS; ComponentLink2URL: https://datasheet.octopart.com:443/M50-1920005-Harwin-datasheet-27707384.pdf?src-supplier=Newark; ComponentLink2Description: https://datasheet.octopart.com:443/M50-1920005-Harwin-datasheet-27707384.pdf?src-supplier=Newark; ComponentLink3URL: https://datasheet.octopart.com:443/M50-1920005-Harwin-datasheet-10841850.pdf?src-supplier=element14+APAC; ComponentLink3Description: https://datasheet.octopart.com:443/M50-1920005-Harwin-datasheet-10841850.pdf?src-supplier=element14+APAC; LCSC part number: C6985646